# Altium schematic sheet power_simp.SchDoc
size A; SheetNumber: 3; SheetTotal: 9; PageSetup: Record=PageOptions|CenterHorizontal=True|CenterVertical=True|PrintScale=1.05|XCorrection=1.00|YCorrection=1.00|PrintKind=0|BorderSize=5000000|LeftOffset=0|BottomOffset=0|Orientation=2|PaperLength=1000|PaperWidth=1000|Scale=100|PaperSource=276|PrintQuality=-3|MediaType=1|DitherType=10|PrintScaleMode=1|PaperKind=Letter 8.5"x11" 22x28cm|PaperIndex=1
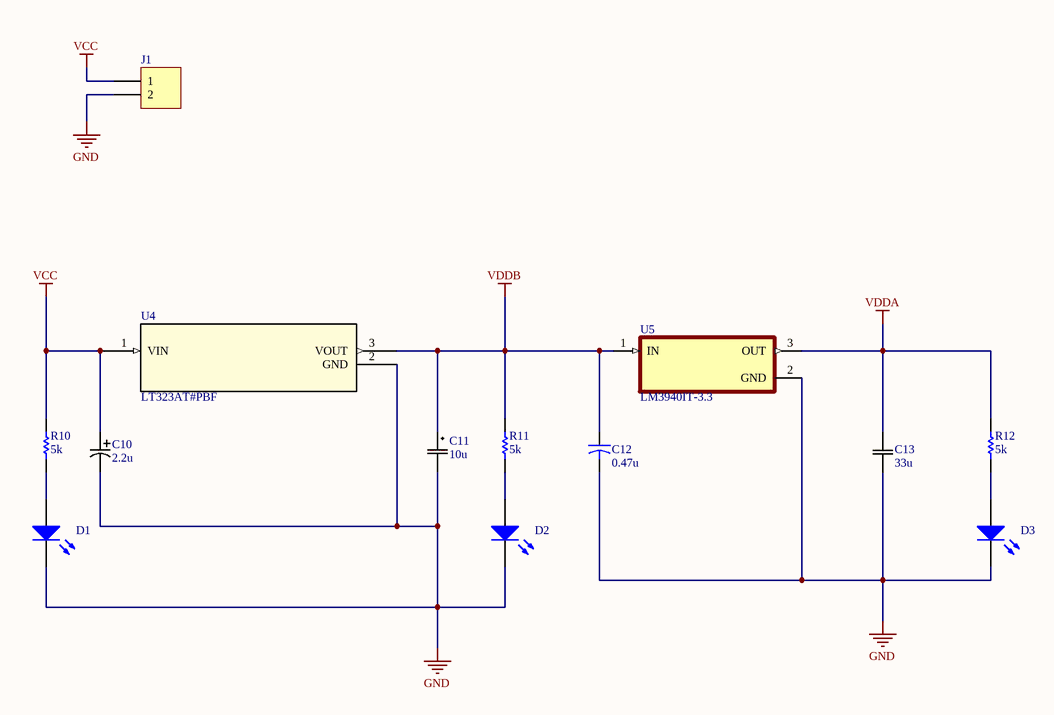
[diagram p0: power_simp.SchDoc]

## Parts
C10  2.2u  [PCAP_3x5-THRU-ELECT_NCA]
C11  10u  [CAP_UHC_4X7_NCH]
C12  value 0.47u  [CAPR5-4X5]  (hidden comment: Cap2)
C13  33u  [CAP_FG16X5R1E336MRT06_TDK]
D1  LED1  [LED-1]  (value not drawn)
D2  LED1  [LED-1]  (value not drawn)
D3  LED1  [LED-1]  (value not drawn)
J1  Header 2  [HDR1X2]  (value not drawn)
R10  value 5k  [AXIAL-0.3]  (hidden comment: Res1)
R11  value 5k  [AXIAL-0.3]  (hidden comment: Res1)
R12  value 5k  [AXIAL-0.3]  (hidden comment: Res1)
U4  LT323AT#PBF  [TO-220-AB]
U5  LM3940IT-3.3  [TO254P1054X470X1955-3]

## Nets
GND: C10.2 C11.2 C12.2 C13.1 D1.2(K) D2.2(K) D3.2(K) J1.2 U4.2(GND) U5.2(GND)
VCC: C10.1 J1.1 R10.2 U4.1(VIN)
VDDA: C13.2 R12.2 U5.3(OUT)
VDDB: C11.1 C12.1 R11.2 U4.3(VOUT) U5.1(IN)
NetD1_1: D1.1(A) R10.1
NetD2_1: D2.1(A) R11.1
NetD3_1: D3.1(A) R12.1

## Library data of the parts
C10 = UMA1V2R2MCD2: No Description Available; Mfr_Name: Nichicon
C11 = USR1E100MDD1TE: No Description Available; Mfr_Name: Nichicon
C12 = Cap2: Capacitor; Published: 23-Sep-2002; PackageReference: CAPR5-4X5; Publisher: Altium Limited; PackageDescription: Capacitor; 2 Leads
C13 = FG16X5R1E336MRT06: No Description Available; Mfr_Name: TDK
D1-D3 = LED1: Typical RED GaAs LED; Published: 8-Jun-2000; LatestRevisionDate: 08-Jul-2005; LatestRevisionNote: Mech Layer 1 removed.; PackageReference: LED-1; Publisher: Altium Limited; PackageDescription: LED; 2 Leads
J1 = Header 2: Header, 2-Pin; LatestRevisionDate: 17-Jul-2002; LatestRevisionNote: Re-released for DXP Platform.; Publisher: Altium Limited
R10-R12 = Res1: Resistor; Published: 8-Jun-2000; LatestRevisionDate: 17-Jul-2002; LatestRevisionNote: Re-released for DXP Platform.; PackageReference: AXIAL-0.3; Publisher: Altium Limited; PackageDescription: Axial Device, Thru-Hole; 2 Leads; 0.3 in Pin Spacing
U4 = LT323AT#PBF: No Description Available; Mfr_Name: Analog Devices / Linear Technology; Copyright: Copyright (C) 2022 Ultra Librarian. All rights reserved.; Manufacturer_Part_Number: LT323AT#PBF; Digi-Key_Part_Number_1: LT323AT#PBF-ND; RefDes: RefDes; Type: DEV
U5 = LM3940IT-3.3: 1-A, low-dropout voltage regulator for 5-V to 3.3-V conversion 3-TO-220 -40 to 125; MF: Texas Instruments; SnapEDA_Link: https://www.snapeda.com/parts/LM3940IT-3.3/Texas%20Instruments/view-part/50717/?ref=snap; Availability: Warning; Price: None; MP: LM3940IT-3.3; Check_prices: https://www.snapeda.com/parts/LM3940IT-3.3/Texas%20Instruments/view-part/50717/?ref=eda; Purchase-URL: https://pricing.snapeda.com/search/part/LM3940IT-3.3/?ref=eda; Package: TO-220-3 Texas Instruments; Value: *